# EAGLE design ATOM - 3x Attenuverter Rev5 (EAGLE 9.6.2)
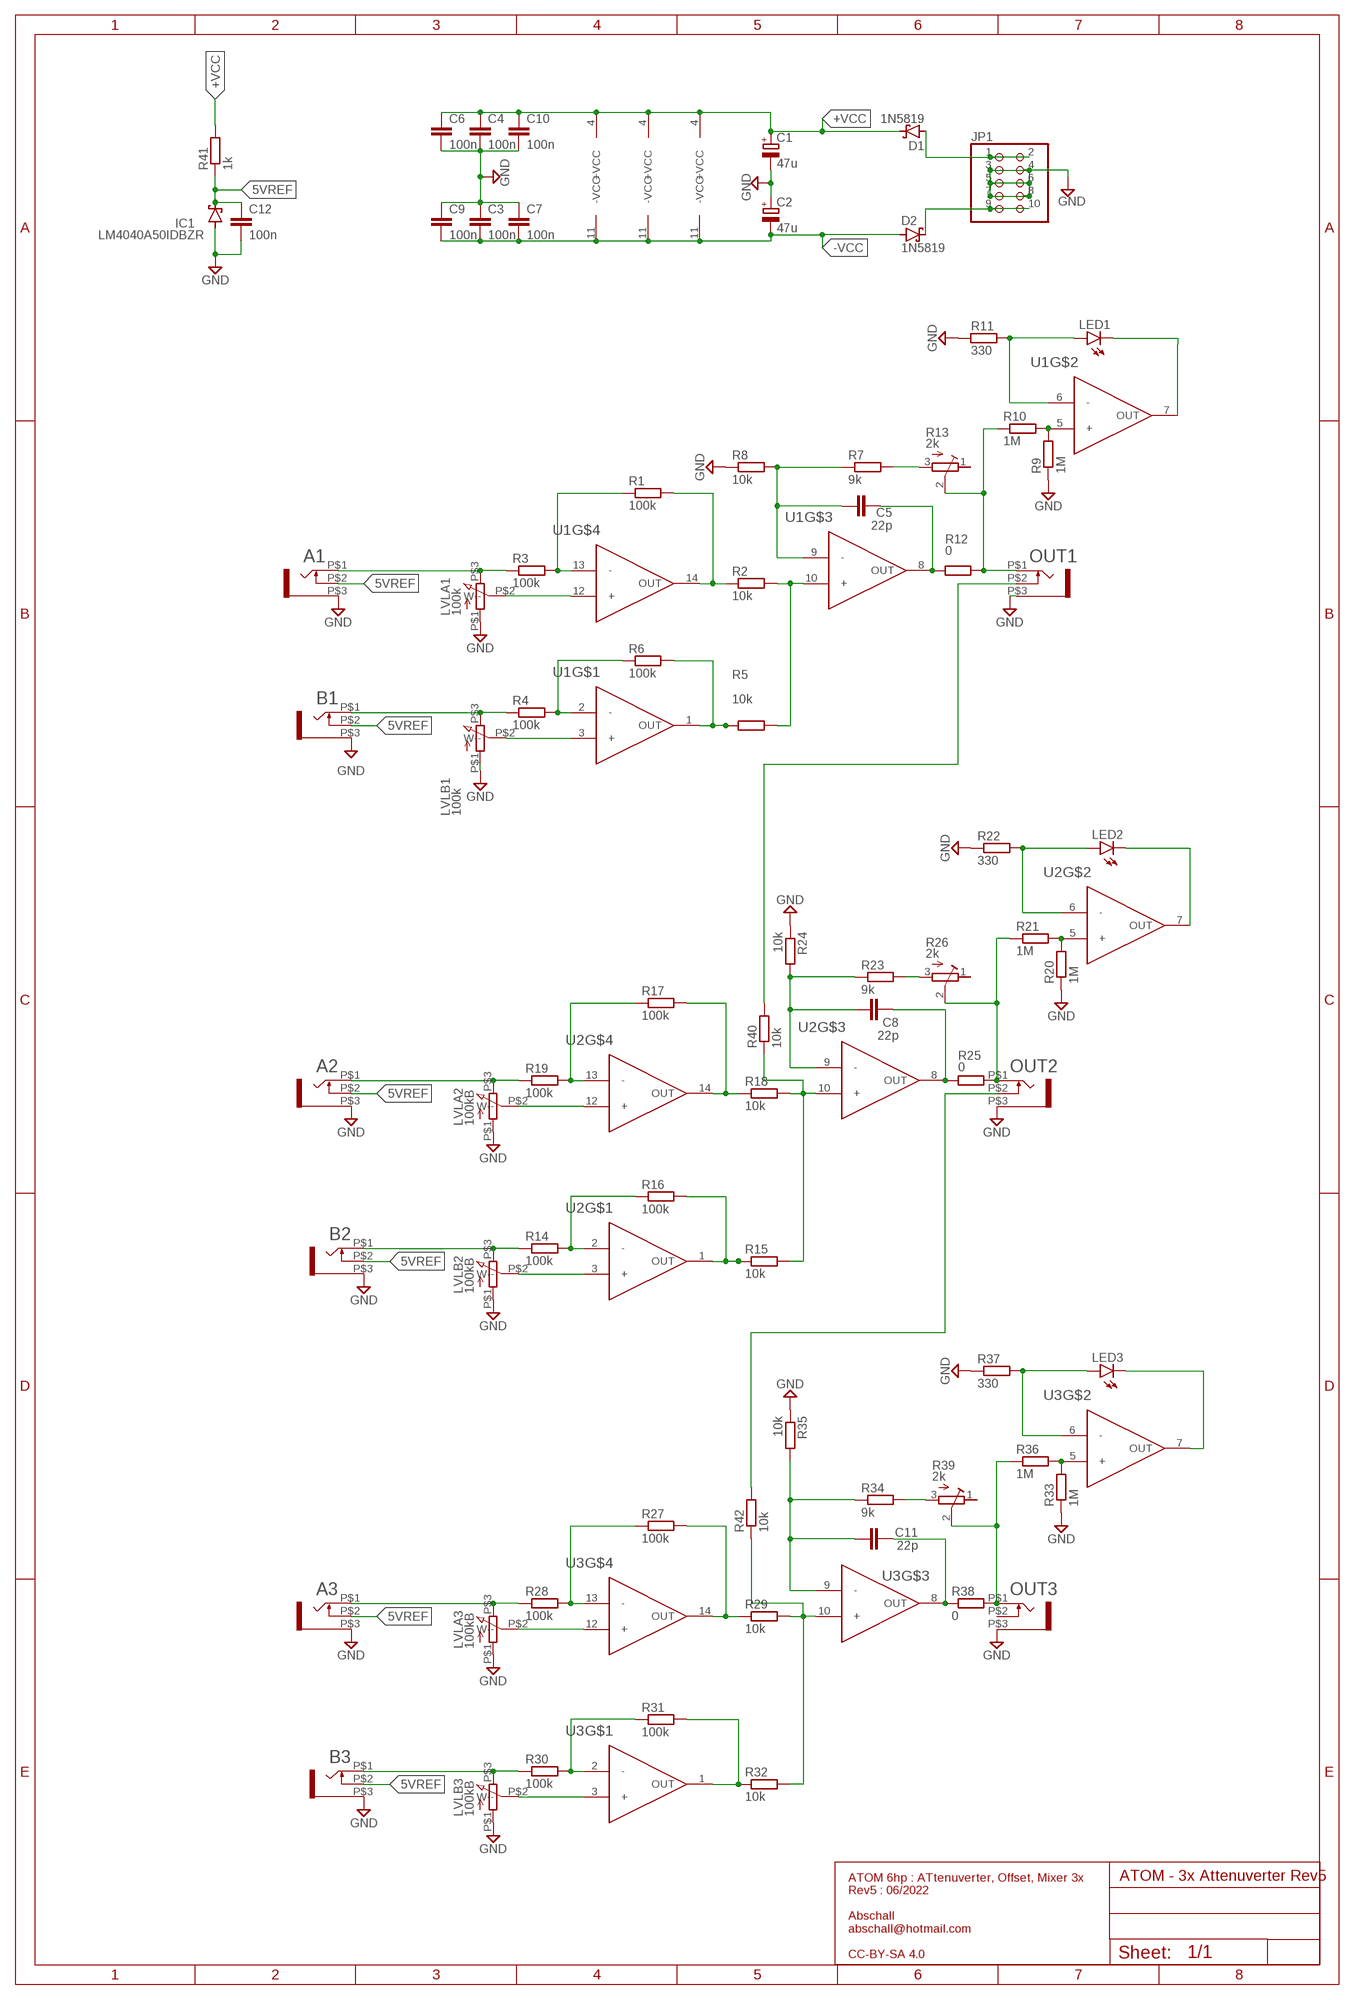
[diagram p0: schematic, sheet 1]

## Parts
A1  WQP-PJ301M-12_JACK  [WQP-PJ301M-12_JACK]
A2  WQP-PJ301M-12_JACK  [WQP-PJ301M-12_JACK]
A3  WQP-PJ301M-12_JACK  [WQP-PJ301M-12_JACK]
B1  WQP-PJ301M-12_JACK  [WQP-PJ301M-12_JACK]
B2  WQP-PJ301M-12_JACK  [WQP-PJ301M-12_JACK]
B3  WQP-PJ301M-12_JACK  [WQP-PJ301M-12_JACK]
C1  47u  CPOL-EUB  [PANASONIC_B]
C2  47u  CPOL-EUB  [PANASONIC_B]
C3  100n  C-EUC0805  [C0805]
C4  100n  C-EUC0805  [C0805]
C5  22p  C-EUC0805  [C0805]
C6  100n  C-EUC0805  [C0805]
C7  100n  C-EUC0805  [C0805]
C8  22p  C-EUC0805  [C0805]
C9  100n  C-EUC0805  [C0805]
C10  100n  C-EUC0805  [C0805]
C11  22p  C-EUC0805  [C0805]
C12  100n  C-EUC0805  [C0805]
D1  1N5819  [SOD123]
D2  1N5819  [SOD123]
IC1  LM4040A50IDBZR  LM4040  [SOT23]
JP1  PINHD-2X5  [2X05]
LED1  LED3MM  [LED3MM]
LED2  LED3MM  [LED3MM]
LED3  LED3MM  [LED3MM]
LVLA1  100k  ALPHA9MM  [ALPHA9MM]
LVLA2  100kB  ALPHA9MM  [ALPHA9MM]
LVLA3  100kB  ALPHA9MM  [ALPHA9MM]
LVLB1  100k  ALPHA9MM  [ALPHA9MM]
LVLB2  100kB  ALPHA9MM  [ALPHA9MM]
LVLB3  100kB  ALPHA9MM  [ALPHA9MM]
OUT1  WQP-PJ301M-12_JACK  [WQP-PJ301M-12_JACK]
OUT2  WQP-PJ301M-12_JACK  [WQP-PJ301M-12_JACK]
OUT3  WQP-PJ301M-12_JACK  [WQP-PJ301M-12_JACK]
R1  100k  R-EU_R0805  [R0805]
R2  10k  R-EU_R0805  [R0805]
R3  100k  R-EU_R0805  [R0805]
R4  100k  R-EU_R0805  [R0805]
R5  10k  R-EU_R0805  [R0805]
R6  100k  R-EU_R0805  [R0805]
R7  9k  R-EU_R0805  [R0805]
R8  10k  R-EU_R0805  [R0805]
R9  1M  R-EU_R0805  [R0805]
R10  1M  R-EU_R0805  [R0805]
R11  330  R-EU_R0805  [R0805]
R12  0  R-EU_R0805  [R0805]
R13  2k  R-TRIMM3314J  [RTRIM3314J]
R14  100k  R-EU_R0805  [R0805]
R15  10k  R-EU_R0805  [R0805]
R16  100k  R-EU_R0805  [R0805]
R17  100k  R-EU_R0805  [R0805]
R18  10k  R-EU_R0805  [R0805]
R19  100k  R-EU_R0805  [R0805]
R20  1M  R-EU_R0805  [R0805]
R21  1M  R-EU_R0805  [R0805]
R22  330  R-EU_R0805  [R0805]
R23  9k  R-EU_R0805  [R0805]
R24  10k  R-EU_R0805  [R0805]
R25  0  R-EU_R0805  [R0805]
R26  2k  R-TRIMM3314J  [RTRIM3314J]
R27  100k  R-EU_R0805  [R0805]
R28  100k  R-EU_R0805  [R0805]
R29  10k  R-EU_R0805  [R0805]
R30  100k  R-EU_R0805  [R0805]
R31  100k  R-EU_R0805  [R0805]
R32  10k  R-EU_R0805  [R0805]
R33  1M  R-EU_R0805  [R0805]
R34  9k  R-EU_R0805  [R0805]
R35  10k  R-EU_R0805  [R0805]
R36  1M  R-EU_R0805  [R0805]
R37  330  R-EU_R0805  [R0805]
R38  0  R-EU_R0805  [R0805]
R39  2k  R-TRIMM3314J  [RTRIM3314J]
R40  10k  R-EU_R0805  [R0805]
R41  1k  R-EU_R0805  [R0805]
R42  10k  R-EU_R0805  [R0805]
U1  TL74H  [SO14]
U2  TL74H  [SO14]
U3  TL74H  [SO14]

## Nets
5VREF: A1.P$2 A2.P$2 A3.P$2 B1.P$2 B2.P$2 B3.P$2 C12.1 IC1.1(C) R41.1
+VCC: C1.+ C4.1 C6.1 C10.1 D1.C R41.2 U1.4(+VCC) U2.4(+VCC) U3.4(+VCC)
-VCC: C2.- C3.2 C7.2 C9.2 D2.A U1.11(-VCC) U2.11(-VCC) U3.11(-VCC)
GND: A1.P$3 A2.P$3 A3.P$3 B1.P$3 B2.P$3 B3.P$3 C1.- C2.+ C3.1 C4.2 C6.2 C7.1 C9.1 C10.2 C12.2 IC1.2(A) JP1.3 JP1.4 JP1.5 JP1.6 JP1.7 JP1.8 LVLA1.P$1 LVLA2.P$1 LVLA3.P$1 LVLB1.P$1 LVLB2.P$1 LVLB3.P$1 OUT1.P$3 OUT2.P$3 OUT3.P$3 R8.1 R9.1 R11.1 R20.1 R22.1 R24.1 R33.1 R35.1 R37.1
N$1: A1.P$1 LVLA1.P$3 R3.1
N$2: R1.1 R3.2 U1.13(-)
N$3: LVLB1.P$2(W--) U1.3(+)
N$4: R1.2 R2.1 U1.14(OUT)
N$5: R2.2 R5.2 U1.10(+)
N$6: R5.1 R6.2 U1.1(OUT)
N$7: R4.2 R6.1 U1.2(-)
N$8: B1.P$1 LVLB1.P$3 R4.1
N$10: C5.1 R7.1 R8.2 U1.9(-)
N$11: OUT1.P$1 R10.1 R12.2 R13.2(S)
N$12: LED1.A R11.2 U1.6(-)
N$13: LED1.K(C) U1.7(OUT)
N$14: R9.2 R10.2 U1.5(+)
N$15: A2.P$1 LVLA2.P$3 R19.1
N$16: LVLA1.P$2(W--) U1.12(+)
N$17: R17.1 R19.2 U2.13(-)
N$18: R17.2 R18.1 U2.14(OUT)
N$19: R15.2 R18.2 R40.1 U2.10(+)
N$20: R14.2 R16.1 U2.2(-)
N$21: C8.1 R23.1 R24.2 U2.9(-)
N$22: B2.P$1 LVLB2.P$3 R14.1
N$23: OUT2.P$1 R21.1 R25.2 R26.2(S)
N$24: LED2.A R22.2 U2.6(-)
N$25: LED2.K(C) U2.7(OUT)
N$26: R20.2 R21.2 U2.5(+)
N$27: R15.1 R16.2 U2.1(OUT)
N$28: LVLA2.P$2(W--) U2.12(+)
N$29: A3.P$1 LVLA3.P$3 R28.1
N$30: LVLB2.P$2(W--) U2.3(+)
N$31: R27.1 R28.2 U3.13(-)
N$32: R27.2 R29.1 U3.14(OUT)
N$33: R29.2 R32.2 R42.1 U3.10(+)
N$34: R30.2 R31.1 U3.2(-)
N$35: C11.1 R34.1 R35.2 U3.9(-)
N$36: B3.P$1 LVLB3.P$3 R30.1
N$37: R23.2 R26.3(A)
N$38: LED3.A R37.2 U3.6(-)
N$39: LED3.K(C) U3.7(OUT)
N$40: R33.2 R36.2 U3.5(+)
N$41: R31.2 R32.1 U3.1(OUT)
N$42: LVLA3.P$2(W--) U3.12(+)
N$43: D2.C JP1.9 JP1.10
N$44: D1.A JP1.1 JP1.2
N$45: LVLB3.P$2(W--) U3.3(+)
N$46: C5.2 R12.1 U1.8(OUT)
N$47: C8.2 R25.1 U2.8(OUT)
N$48: C11.2 R38.1 U3.8(OUT)
N$49: OUT2.P$2 R42.2
N$50: OUT1.P$2 R40.2
N$51: OUT3.P$1 R36.1 R38.2 R39.2(S)
N$52: R7.2 R13.3(A)
N$53: R34.2 R39.3(A)
Unconnected: OUT3.P$2 R13.1(E) R26.1(E) R39.1(E)

## Notes on the sheet
- ATOM 6hp : ATtenuverter, Offset, Mixer 3x
  Rev5 : 06/2022
  
  Abschall
  abschall@hotmail.com
  
  CC-BY-SA 4.0

## Library data of the parts
A1-A3 B1-B3 OUT1-OUT3 = thonkiconn:WQP-PJ301M-12_JACK
C1 C2 = rcl:CPOL-EU: POLARIZED CAPACITOR, European symbol; SPICEPREFIX: C
C3-C12 = resistor:C-EU: CAPACITOR, European symbol
D1 D2 = personal-ICs:1N5819
IC1 = personal-ICs:LM4040
JP1 = pinhead:PINHD-2X5: PIN HEADER
LED1-LED3 = led:LED: LED OSRAM: - CHIPLED LG R971, LG N971, LY N971, LG Q971, LY Q971, LO R971, LY R971 LH N974, LH R974 LS Q976, LO Q976, LY Q976 LO Q996 - Hyper CHIPLED LW Q18S LB Q993, LB Q99A, LB R99A - SideLED LS A670, LO A670, LY A670, LG A670, LP A670 LB A673, LV A673, LT A673, LW A673 LH A674 LY A675 LS A676, LA A676, LO A676, LY A676, LW A676 LS A679, LY A679, LG A679 - Hyper Micro SIDELED® LS Y876, LA Y876, LO Y876, LY Y876 LT Y87S - SmartLED LW L88C, LW L88S LB L89C, LB L89S, LG L890 LS L89K, LO L89K, LY L89K LS L896, LA L896, LO L896, LY L896 - TOPLED LS T670, LO T670, LY T670, LG T670, LP T670 LSG T670, LSP T670, LSY T670, LOP T670, LYG T670 LG T671, LOG T671, LSG T671 LB T673, LV T673, LT T673, LW T673 LH T674 LS T676, LA T676, LO T676, LY T676, LB T676, LH T676, LSB T676, LW T676 LB T67C, LV T67C, LT T67C, LS T67K, LO T67K, LY T67K, LW E67C LS E67B, LA E67B, LO E67B, LY E67B, LB E67C, LV E67C, LT E67C LW T67C LS T679, LY T679, LG T679 LS T770, LO T770, LY T770, LG T770, LP T770 LB T773, LV T773, LT T773, LW T773 LH T774 LS E675, LA E675, LY E675, LS T675 LS T776, LA T776, LO T776, LY T776, LB T776 LHGB T686 LT T68C, LB T68C - Hyper Mini TOPLED® LB M676 - Mini TOPLED Santana® LG M470 LS M47K, LO M47K, LY M47K Source: http://www.osram.convergy.de LUXEON: - LUMILED® LXK2-PW12-R00, LXK2-PW12-S00, LXK2-PW14-U00, LXK2-PW14-V00 LXK2-PM12-R00, LXK2-PM12-S00, LXK2-PM14-U00 LXK2-PE12-Q00, LXK2-PE12-R00, LXK2-PE12-S00, LXK2-PE14-T00, LXK2-PE14-U00 LXK2-PB12-K00, LXK2-PB12-L00, LXK2-PB12-M00, LXK2-PB14-N00, LXK2-PB14-P00, LXK2-PB14-Q00 LXK2-PR12-L00, LXK2-PR12-M00, LXK2-PR14-Q00, LXK2-PR14-R00 LXK2-PD12-Q00, LXK2-PD12-R00, LXK2-PD12-S00 LXK2-PH12-R00, LXK2-PH12-S00 LXK2-PL12-P00, LXK2-PL12-Q00, LXK2-PL12-R00 Source: www.luxeon.com KINGBRIGHT: KA-3528ASYC Source: www.kingbright.com
LVLA1-LVLA3 LVLB1-LVLB3 = potentiometer:ALPHA9MM
R1-R12 R14-R25 R27-R38 R40-R42 = resistor:R-EU_: RESISTOR, European symbol
R13 R26 R39 = resistor:R-TRIMM: Trimm resistor
U1-U3 = personal devices:TL74H

## Board
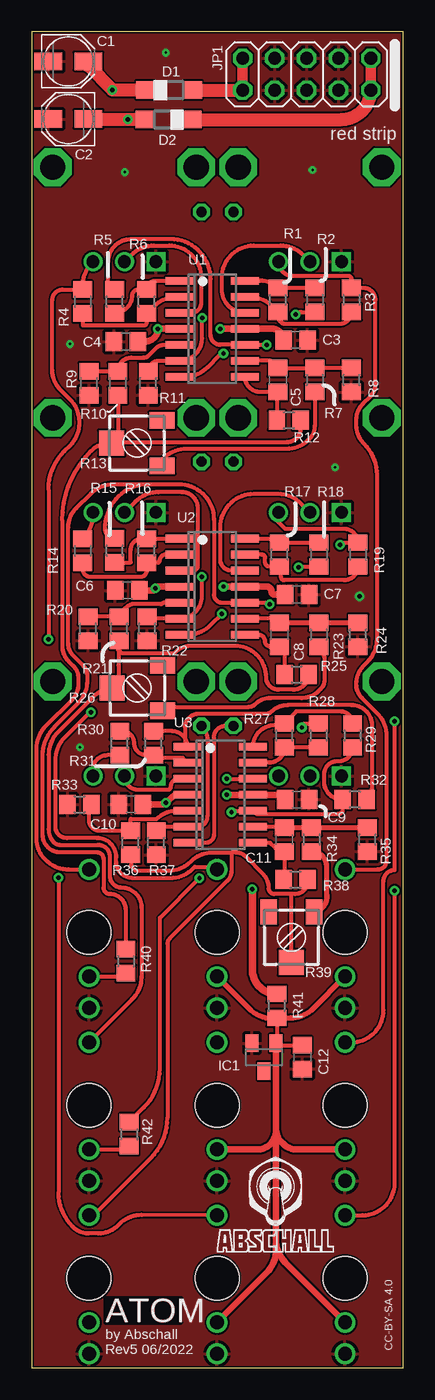
[diagram p1: board, top side]
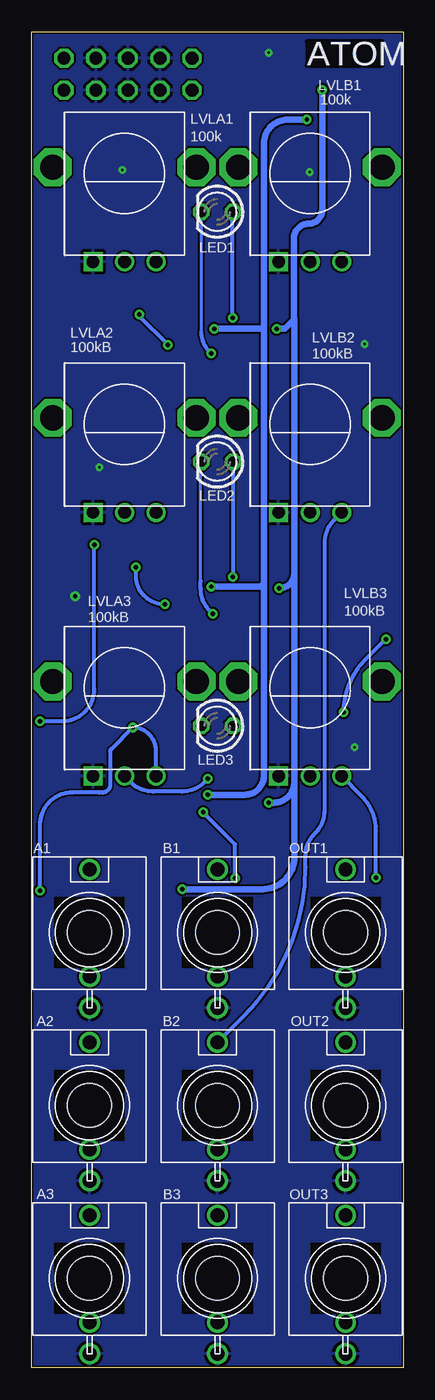
[diagram p2: board, bottom side, seen from below]

Size 29.5 x 106 mm. Coordinates in mm from the lower left corner, seen from the top.
Outline: 0,0 29.5,0 29.5,106 0,106 0,0
Copper layers (1*16): Top 0.035mm / dielectric 1.5mm / Bottom 0.035mm
Design rules "default *": minimum track width 6mil, minimum drill 0.35mm, track to track 6mil, track to pad 6mil, pad to pad 6mil, via to via 6mil, smd to smd 6mil, copper to edge 6mil, drill to drill 6mil, minimum pad ring 10mil, minimum via ring 8mil, stop-mask expansion 4mil, vias tented up to drill 0mil, thermal gap 10mil

### Footprints (pad centres in the part's own frame; a part is rotated, then mirrored left to right if it is on the bottom)
WQP-PJ301M-12_JACK = drill 1.1: P$1 0,5; P$2 0,-3.5; P$3 0,-5.992 | hole 3.5: 0,0
PANASONIC_B = smd 2.2 x 1.4: + 1.6,0; - -1.6,0
C0805 = smd 1.3 x 1.5: 1 -0.95,0; 2 0.95,0
SOD123 = smd 1.4 x 1.4: A 1.9,0; C -1.9,0
SOT23 = smd 1 x 1.4: 1 -0.95,-1.1; 2 0.95,-1.1; 3 0,1.1
2X05 = drill 1.016 octagon: 1 -5.08,-1.27; 2 -5.08,1.27; 3 -2.54,-1.27; 4 -2.54,1.27; 5 0,-1.27; 6 0,1.27; 7 2.54,-1.27; 8 2.54,1.27; 9 5.08,-1.27; 10 5.08,1.27
LED3MM = drill 0.813 octagon: A -1.27,0; K 1.27,0
ALPHA9MM = drill 2 octagon: GND -5.715,0.515; GND2 5.685,0.515 | drill 1 square: P$1 -2.515,-6.985 | drill 1: P$2 -0.015,-6.985; P$3 2.485,-6.985
R0805 = smd 1.3 x 1.5: 1 -0.95,0; 2 0.95,0
RTRIM3314J = smd 1.3 x 2: 1 1.8,-2; 3 -1.8,-2 | smd 2 x 2: 2 0,2
SO14 = smd 0.6 x 2.2: 1 -3.81,-2.6; 2 -2.54,-2.6; 3 -1.27,-2.6; 4 0,-2.6; 5 1.27,-2.6; 6 2.54,-2.6; 7 3.81,-2.6; 8 3.81,2.6; 9 2.54,2.6; 10 1.27,2.6; 11 0,2.6; 12 -1.27,2.6; 13 -2.54,2.6; 14 -3.81,2.6

### Placement (x,y rotation side)
A1  24.89,34.54 0 bottom
A2  24.89,20.83 0 bottom
A3  24.89,7.11 0 bottom
B1  14.73,34.54 0 bottom
B2  14.73,20.83 0 bottom
B3  14.73,7.11 0 bottom
C1  2.92,103.63 0 top
C2  2.92,99.06 180 top
C3  20.95,81.53 180 top
C4  7.49,81.41 180 top
C5  19.56,78.36 270 top
C6  7.6,61.68 180 top
C7  21.08,61.34 180 top
C8  19.68,58.17 270 top
C9  21.08,45.09 180 top
C10  7.87,44.7 180 top
C11  20.07,41.91 270 top
C12  21.5,24.66 270 top
D1  10.92,101.36 0 top
D2  10.88,99.02 180 top
IC1  18.45,24.66 180 top
JP1  21.84,102.62 0 top
LED1  14.76,91.69 180 bottom
LED2  14.76,71.88 180 bottom
LED3  14.76,50.93 180 bottom
LVLA1  22.1,94.73 0 bottom
LVLA2  22.1,74.84 0 bottom
LVLA3  22.1,53.94 0 bottom
LVLB1  7.37,94.73 0 bottom
LVLB2  7.37,74.84 0 bottom
LVLB3  7.37,53.94 0 bottom
OUT1  4.57,34.54 0 bottom
OUT2  4.57,20.83 0 bottom
OUT3  4.57,7.11 0 bottom
R1  19.56,84.71 90 top
R2  22.48,84.71 270 top
R3  25.4,84.71 270 top
R4  4.06,84.58 270 top
R5  6.6,84.58 90 top
R6  9.14,84.58 90 top
R7  22.48,78.36 270 top
R8  25.4,78.36 90 top
R9  4.57,78.11 90 top
R10  6.86,78.11 90 top
R11  9.27,78.11 90 top
R12  20.43,75.17 0 top
R13  8.36,73.35 90 top
R14  4.06,64.82 270 top
R15  6.6,64.84 90 top
R16  9.14,64.81 90 top
R17  19.68,64.52 90 top
R18  22.8,64.52 270 top
R19  25.91,64.52 270 top
R20  4.48,58.64 90 top
R21  6.96,58.64 90 top
R22  9.18,58.64 90 top
R23  22.8,58.17 270 top
R24  25.91,58.17 90 top
R25  21.04,55.02 0 top
R26  8.4,53.93 90 top
R27  20.07,50.16 90 top
R28  22.78,50.16 270 top
R29  25.48,50.16 270 top
R30  7.01,49.55 90 top
R31  9.68,49.55 90 top
R32  25.65,45.09 180 top
R33  3.81,44.7 0 top
R34  22.23,41.91 270 top
R35  26.67,41.91 90 top
R36  7.87,41.66 90 top
R37  9.91,41.66 90 top
R38  20.95,38.73 0 top
R39  20.64,34.17 180 top
R40  7.49,32.26 270 top
R41  19.47,28.72 90 top
R42  7.75,18.54 270 top
U1  14.35,82.42 270 top
U2  14.35,61.98 270 top
U3  14.99,45.47 270 top

### Tracks (layer width: path | path; a pad name or v marks a point on that pad's centre or on a via)
5VREF
  Top 0.305: IC1.1 arc45 19.47,25.91 R41.1 19.35,27.65 | IC1.1 19.4,19.04 19.4,18.82 19.4,18.51 | 19.36,9.32 arc45 19.49,9.01 A3.P$2 | 19.36,9.32 arc-45 18.62,7.53 B3.P$2 | 18.15,17.33 arc90 19.36,18.54 | 19.4,18.51 20.58,17.33 A2.P$2 | 19.4,18.51 arc-90 19.36,18.54 | 19.36,18.54 arc-90 18.15,17.33 | IC1.1 19.55,25.61 C12.1 | 18.15,17.33 B2.P$2 | 19.36,18.54 19.36,9.32
  Top 0.406: B1.P$2 17.26,28.51 arc45 19.35,27.65 | R41.1 20.57,27.77 arc45 22.36,28.51 A1.P$2
  Top 0.508: 19.47,25.91 arc90 19.4,25.85 19.4,19.04 arc90 21.11,17.33 A2.P$2 | B2.P$2 17.91,17.33 arc90 19.4,18.82 19.4,10.15 | A3.P$2 20.14,8.36 arc-45 19.4,10.15 | B3.P$2 18.66,7.54 arc45 19.4,9.33 19.4,10.15
+VCC  (via drill 0.35)
  Top 0.508: U1.4 v10.03,82.42 arc-90 9.02,81.41 C4.1 | U2.4 9.97,61.98 arc90 v9.84,61.84 9.67,61.68 C6.1 | U3.4 11.81,45.47 arc45 10.94,45.11 v10.67,44.83 10.54,44.7 C10.1
  Top 0.61: R41.2 arc-90 17.53,31.61 v17.53,37.97
  Top 1.016: C1.+ arc90 4.52,103.27 v6.43,101.36 D1.C
  Bottom 0.508: 8.64,63.05 8.64,83.19 arc90 8.68,83.14 | 8.64,63.05 arc90 v9.84,61.84 | 8.64,63.05 8.64,46.49 | v10.67,44.83 10.29,44.83 arc-90 8.64,46.49 | v10.03,82.42 9.4,82.42 8.68,83.14 | 8.64,46.49 8.64,40.51 arc90 11.18,37.97 v17.53,37.97 | 8.68,83.14 8.68,89.58 arc90 7.5,90.75 arc-90 6.43,91.83 v6.43,101.36
-VCC  (via drill 0.35)
  Top 0.508: v14.99,82.42 U1.11 19.12,82.42 arc-90 C3.2 | v15.24,61.98 U2.11 18.67,61.98 arc-90 19.05,61.59 arc90 19.3,61.34 C7.2 | v15.49,45.47 U3.11 19.75,45.47 arc-90 C9.2
  Top 1.016: D2.A v7.64,99.02 4.56,99.02 arc-90 C2.-
  Bottom 0.508: v14.99,82.42 11.18,82.42 11.05,82.55 | 11.05,82.55 11.05,97.12 arc90 9.15,99.01 v7.65,99.01 v7.64,99.02 | 11.05,82.55 11.05,62.36 | 11.05,62.36 arc90 11.43,61.98 v15.24,61.98 | 11.05,62.36 11.05,46.99 arc90 12.57,45.47 v15.49,45.47
GND  (via drill 0.2, 0.35)
  other vias: 26.04,61.21 3.86,49.24 7.42,94.84 22.3,95.03 24.11,71.44 3.06,81.21 10.66,104.32
  pour Top: -0.73,106.03 -0.73,-0.13 29.72,-0.13 29.72,106.8
  pour Bottom: -0.13,106.05 -0.13,-0.13 29.59,-0.13 29.59,106.05
N$1
  Top 0.305: LVLA1.P$3 arc90 20.73,86.61 25.15,86.61 arc-90 25.4,86.36 R3.1 26.36,85.66 arc-90 27.3,84.71 27.3,78.01 arc-45 26.92,77.09 26.32,76.48 arc45 25.78,75.18 25.78,74.81 arc45 26.42,73.28 26.43,73.26 arc-45 27.43,70.85 27.43,57.85 arc-45 26.67,56.01 26.41,55.75 arc45 25.78,54.23 arc45 26.23,53.15 27.45,51.92 arc-45 28.19,50.13 28.19,40.26 arc-90 27.48,39.54 A1.P$1
N$2
  Top 0.305: U1.13 17.3,84.96 arc-45 19.1,84.22 R1.1 19.56,83.44 arc90 20.19,82.8 24.45,82.8 arc90 R3.2
N$3
  Top 0.305: LVLB1.P$2 7.93,88.28 arc-45 9.73,89.03 10.92,89.03 arc-90 13.46,86.49 13.46,84.45 arc-90 12.7,83.69 U1.3
N$4
  Top 0.305: U1.14 18.17,86.23 arc-45 R1.2 R2.1
N$5  (via drill 0.35)
  Top 0.305: v18.67,81.15 U1.10 14.99,81.15 arc-90 14.22,81.92 14.22,86.36 arc90 11.05,89.53 7.87,89.53 arc90 6.1,87.76 6.1,86.49 6.1,86.04 arc90 R5.2 | v20.95,83.57 arc-45 21.42,83.76 R2.2
  Bottom 0.305: v18.67,81.15 20.86,83.35 arc45 v20.95,83.57
N$6
  Top 0.305: U1.1 9.85,86.23 arc90 R6.2 8.44,85.53 arc90 8,85.09 arc-90 6.6,83.69 R5.1
N$7
  Top 0.305: U1.2 11.53,84.96 arc45 9.73,84.22 R6.1 9.14,82.93 arc-90 8.89,82.68 4.06,82.68 R4.2
N$8  (via drill 0.35)
  Top 0.305: LVLB1.P$3 arc45 4.06,85.76 R4.1 2.47,85.53 arc90 1.65,84.71 1.65,79.13 arc45 2.29,77.6 3.07,76.82 arc-45 3.81,75.02 3.81,74.93 arc-45 3.09,73.2 2.6,72.7 arc45 1.35,69.68 v1.35,57.78 | v4.71,52.01 4.67,52.04 2.66,50.03 arc45 1.91,48.2 1.91,42.93 arc90 2.79,42.04 5.21,42.04 arc-90 6.73,40.51 6.73,40.13 arc90 8,38.86 11.04,38.86 arc45 12.79,39.59 12.95,39.75 14.23,39.75 arc-45 B1.P$1
  Bottom 0.305: v4.71,52.01 arc45 2.97,56.21 1.4,57.78 v1.35,57.78
N$10
  Top 0.152: 19.94,79.31 C5.1 18.98,79.88
  Top 0.305: 18.98,79.88 U1.9 | R8.2 R7.1 19.94,79.31
N$11
  Top 0.152: R13.2 6.86,73.85 6.86,76.84
  Top 0.305: OUT1.P$1 2.92,39.54 arc-45 1.13,40.29 1.04,40.38 arc-45 0.38,41.96 0.38,49.11 arc-45 1.12,50.91 3.17,52.96 arc45 3.72,54.27 3.72,54.71 arc45 3.31,55.69 2.91,56.09 arc-45 2.45,57.21 2.45,67.2 arc-45 4.75,72.76 arc-45 6.4,73.44 6.9,73.44 | 7.13,73.44 arc45 6.95,73.37 arc-45 6.86,73.58 6.86,76.84 R10.1 | 6.9,73.44 7.13,73.44 | 7.13,73.44 20.28,73.44 arc90 21.38,74.54 R12.2 | 6.91,73.4 arc-45 6.9,73.44
  Top 0.508: 6.95,73.37 6.91,73.4 arc-45 6.9,73.44
N$12  (via drill 0.35)
  Top 0.305: R11.2 arc-90 10.1,79.88 U1.6 arc90 13.54,81.67 v13.54,83.27
  Bottom 0.254: LED1.A arc-45 13.54,91.58 13.54,91.4
  Bottom 0.305: v13.54,83.27 13.54,91.4 13.54,91.65 | 13.54,91.65 arc45 13.54,91.65
N$13  (via drill 0.35)
  Top 0.305: U1.7 12.16,78.61 arc45 13.95,79.36 14.94,80.35 arc-45 v15.24,80.47
  Bottom 0.254: LED1.K 16.03,82.18
  Bottom 0.305: v15.24,80.47 15.38,80.61 arc45 16.03,82.18
N$14
  Top 0.305: R9.2 R10.2 arc-90 7.94,80.14 8.89,80.14 arc45 9.32,80.32 9.91,80.9 arc-45 10.52,81.15 U1.5
N$15  (via drill 0.35)
  Top 0.305: LVLA2.P$3 arc90 19.61,67.08 20.15,66.55 24.83,66.55 arc-90 R19.1 24.7,65.47 arc90 v24.51,65.28 | v28.83,51.31 28.83,39.5 arc90 27.94,38.61 27.94,28.37 arc-90 25.4,25.83 A2.P$1
  Bottom 0.305: v28.83,51.31 27.05,51.31 arc-90 24.51,53.85 v24.51,65.28
N$16
  Top 0.305: U1.12 arc-90 15.11,85.53 15.11,86.49 arc-90 17.65,89.03 19.77,89.03 arc-45 21.56,88.28 LVLA1.P$2
N$17
  Top 0.305: R19.2 arc-90 24.83,62.48 20.07,62.48 arc-90 19.81,62.74 19.81,63.44 arc90 R17.1 18.86,63.57 arc-90 18.54,63.88 18.54,64.26 arc90 18.29,64.52 U2.13
N$18
  Top 0.305: U2.14 19.36,65.79 arc-90 R17.2 R18.1
N$19  (via drill 0.35)
  Top 0.305: R15.2 arc-90 5.85,66.55 arc-45 6.93,69.16 6.95,69.18 arc-45 9.18,70.1 | 9.18,70.1 11.68,70.1 arc-90 14.48,67.31 14.48,61.34 arc90 15.11,60.71 U2.10 18.77,60.71 arc-90 v18.92,60.56 | v21.21,63.5 arc-90 21.27,63.57 R18.2 | R40.1 7.49,36.32 arc90 6.22,37.59 arc-90 5.71,38.1 5.71,40.39 arc90 5.21,40.89 2.29,40.89 arc-90 0.89,42.29 0.89,48.59 arc-45 1.82,50.85 1.9,50.92 3.7,52.72 arc45 4.45,54.52 4.45,54.86 arc45 4.09,55.73 3.3,56.52 arc-45 2.92,57.44 2.92,66.67 arc-45 3.55,68.19 4.72,69.36 arc-45 6.51,70.1 9.18,70.1
  Bottom 0.305: v18.92,60.56 arc90 21.21,62.84 v21.21,63.5
N$20
  Top 0.305: U2.2 10.67,64.52 arc90 10.16,64.01 arc-90 10.02,63.87 R16.1 9.14,63.25 arc-90 8.64,62.74 4.7,62.74 arc-90 4.06,63.37 R14.2
N$21
  Top 0.305: 19.36,59.44 U2.9 | R23.1 24.26,59.12
  Top 0.406: R24.2 24.26,59.12 C8.1 19.36,59.44
N$22
  Top 0.305: LVLB2.P$3 4.88,67.74 arc-45 R14.1
  Bottom 0.305: B2.P$1 12.64,27.92 arc-45 7.75,39.73 7.75,40.6 arc45 7,42.4 6.97,42.44 arc-45 6.22,44.23 6.22,65.45 arc45 5.48,67.25 LVLB2.P$3
N$23
  Top 0.152: R26.2 6.9,54.43 6.9,55.72
  Top 0.305: R25.2 R25.2 arc-90 20.78,53.8 19.6,53.8 arc-90 18.63,54.77 arc90 16.12,57.28 12.74,57.28 arc45 11.3,56.68 7.2,56.68 6.96,56.93 | 6.96,56.93 arc-90 6.87,57.01 arc-90 6.9,56.99 6.9,55.72 6.9,54.04 6.95,53.99 6.71,53.99 arc45 4.91,53.24 2.1,50.43 arc45 1.36,48.64 1.36,42.71 arc45 1.79,41.68 arc45 2.23,41.5 5.28,41.5 arc-90 6.21,40.57 6.21,39.04 arc90 7.14,38.11 arc-90 8.73,36.53 8.73,31.04 arc-45 7.98,29.24 OUT2.P$1 | 6.96,56.93 R21.1
N$24  (via drill 0.35)
  Top 0.305: R22.2 arc-90 9.34,59.44 U2.6 arc90 13.52,61.21 v13.52,62.76
  Bottom 0.254: LED2.A arc-45 13.52,71.81
  Bottom 0.305: 13.52,71.81 v13.52,62.76
N$25  (via drill 0.35)
  Top 0.305: v15.11,59.82 14.21,58.91 arc-45 12.41,58.17 U2.7
  Bottom 0.254: 16.07,62.41 16.07,71.81 arc45 LED2.K
  Bottom 0.305: v15.11,59.82 15.32,60.03 arc45 16.07,61.82 16.07,62.41 16.07,62.42
N$26
  Top 0.305: U2.5 10.59,60.71 arc45 10.29,60.58 10.28,60.59 7.95,60.59 arc45 R21.2 R20.2
N$27
  Top 0.305: U2.1 9.16,65.79 arc90 R16.2 8.74,65.77 arc90 7.87,64.9 7.87,63.89 R15.1
N$28
  Top 0.305: U2.12 15.88,63.25 arc-90 14.99,64.14 14.99,66.67 arc-90 17.65,69.34 19.56,69.34 arc-45 21.36,68.6 LVLA2.P$2
N$29  (via drill 0.35)
  Top 0.305: v21.46,50.8 arc-90 21.78,51.12 R28.1 | A3.P$1 26.29,12.11 arc90 28.83,14.65 v28.83,37.85
  Bottom 0.305: LVLA3.P$3 19.61,48.95 arc-90 v21.46,50.8 23.15,49.11 arc-45 23.24,48.9 23.24,46.28 arc90 23.88,45.64 24.13,45.64 26.29,45.64 arc-90 28.83,43.1 v28.83,37.85
N$30
  Top 0.305: U2.3 12.83,63.25 arc90 13.21,63.63 13.21,68.2 arc90 11.94,69.47 10.06,69.47 arc45 8.26,68.72 LVLB2.P$2
N$31
  Top 0.305: U3.13 18.86,48.01 arc90 R27.1 R28.2
N$32
  Top 0.305: U3.14 arc-90 19.3,50.99 19.94,50.99 arc-90 R27.2 21.02,52.07 24.53,52.07 arc-90 R29.1
N$33  (via drill 0.35)
  Top 0.305: R29.2 arc-90 24.4,48.13 24.26,48.13 arc90 23.24,47.12 23.24,46.48 arc90 24.64,45.09 R32.2 24.7,44.23 arc-45 24.64,44.07 arc-45 24.33,43.94 17.84,43.94 arc90 U3.10 16.18,44.2 arc45 v15.88,44.07 | R42.1 8.91,20.65 arc45 10.19,23.74 10.19,35.72 v13.34,38.86
  Bottom 0.305: v13.34,38.86 13.34,41.53 v15.88,44.07
N$34
  Top 0.305: U3.2 12,48.39 9.68,48.39 R31.1 9.11,48.6 arc-90 8.16,49.55 arc90 7.21,50.5 R30.2
N$35
  Top 0.305: 20,42.93 U3.9
  Top 0.406: R35.2 R34.1 C11.1 20,42.93
N$36  (via drill 0.35)
  Top 0.305: R30.1 6,48.6 arc90 4.88,47.48 LVLB3.P$3 | B3.P$1 8.74,12.14 arc45 6.95,11.39 6.86,11.3 arc-45 5.33,10.67 4.53,10.67 arc-45 3.3,11.18 3.28,11.2 arc-45 2.15,13.91 v2.15,38.88
  Bottom 0.305: v2.15,38.88 2.15,42.62 arc-45 3.28,45.34 LVLB3.P$3
N$37
  Top 0.152: R26.3 10.69,52.43 11.23,52.43
  Top 0.305: 10.45,52.43 11.23,52.43 17.26,52.43 arc45 17.71,52.62 arc-45 18.97,53.14 21.46,53.14 arc45 22.78,53.68 22.95,53.84 arc45 23.26,54.6 23.26,56.11 arc45 R23.2
N$38
  Top 0.254: 13.97,49.78 13.97,49.74
  Top 0.305: R37.2 arc-90 10.23,42.93 U3.6 13.15,42.93 arc90 13.97,43.75 13.97,49.74 | LED3.A arc-45 13.97,49.78
N$39
  Top 0.305: U3.7 13.84,41.66 arc90 14.48,42.29 14.48,50.01 arc-90 15.4,50.93 LED3.K
N$40
  Top 0.305: U3.5 11.49,44.2 arc45 9.96,43.56 7.87,43.56 R36.2 5.4,42.61 arc-90 4.57,43.43 4.57,44.52 arc-90 R33.2
N$41
  Top 0.305: R31.2 11.16,50.5 arc-90 U3.1 arc-90 12.19,49.47 12.19,50.8 arc-90 13.29,51.9 18.67,51.9 arc45 19.01,52.04 arc-45 20.32,52.58 25.4,52.58 arc-90 27.05,50.93 27.05,46.16 arc-45 R32.1
N$42  (via drill 0.35)
  Top 0.305: v15.49,46.74 U3.12
  Bottom 0.305: v15.49,46.74 15.77,46.46 arc45 17.56,45.72 19.84,45.72 arc45 21.64,46.46 LVLA3.P$2
N$43
  Top 0.813: JP1.9 JP1.10
  Top 1.016: D2.C 24.6,99.02 arc90 JP1.9
N$44
  Top 0.813: JP1.2 JP1.1
  Top 1.016: D1.A JP1.1 arc-90 JP1.1
N$45
  Top 0.305: LVLB3.P$2 arc90 8.47,45.85 10.79,45.85 arc90 11.05,46.1 arc-90 11.68,46.74 U3.3
N$46
  Top 0.305: U1.8 arc90 18.16,77.41 C5.2 19.48,77.33 R12.1
N$47
  Top 0.305: U2.8 18.03,58.17 arc-90 18.52,57.68 arc90 18.98,57.22 C8.2 arc-90 20.09,56.81 R25.1
N$48
  Top 0.305: U3.8 18.93,41.66 arc-45 18.94,41.65 19.32,41.27 arc45 C11.2 20.07,38.88 arc-45 R38.1
N$49
  Top 0.305: OUT2.P$2 7.11,17.33 arc45 R42.2
N$50
  Top 0.305: OUT1.P$2 6.86,31.04 arc45 R40.2
N$51
  Top 0.305: R36.1 arc-45 7.89,40.67 7.89,39.86 arc45 7.92,39.78 8.26,39.44 10.87,39.44 arc45 12.67,40.19 12.69,40.21 arc-45 14.3,40.88 15.87,40.88 | 15.87,40.88 15.87,39.37 arc-45 15.58,38.66 10.96,34.05 arc45 10.8,33.65 10.8,19.84 arc-45 9.48,16.65 5.19,12.37 arc-45 OUT3.P$1 | R38.2 21.91,38.56 arc-90 20.94,37.6 20.67,37.6 | 20.67,37.6 19.27,37.6 arc-90 18.82,38.04 arc45 18.33,39.23 17.01,40.56 arc45 16.23,40.88 15.87,40.88 | R39.2 20.64,37.56 arc-90 20.67,37.6
N$52
  Top 0.152: R13.3 10.5,71.69 10.5,72.17
  Top 0.305: 10.45,72.12 10.5,72.17 arc-45 12.29,72.91 20.24,72.91 arc45 22.04,73.66 arc45 22.48,74.73 R7.2
N$53
  Top 0.406: R39.3 arc90 23.44,37.63 23.44,39.74 arc90 R34.2

### Text on the board
Top: ATOM
Bottom: ATOM
tPlace: red strip | D:/Images/Inkspace/Upschall/Abschall Vertical Logo Simple.bmp | ATOM | by Abschall / Rev5 06/2022 | CC-BY-SA 4.0
bPlace: ATOM